# Altium schematic sheet SD.SchDoc
size B; SheetNumber: 5; SheetTotal: 5
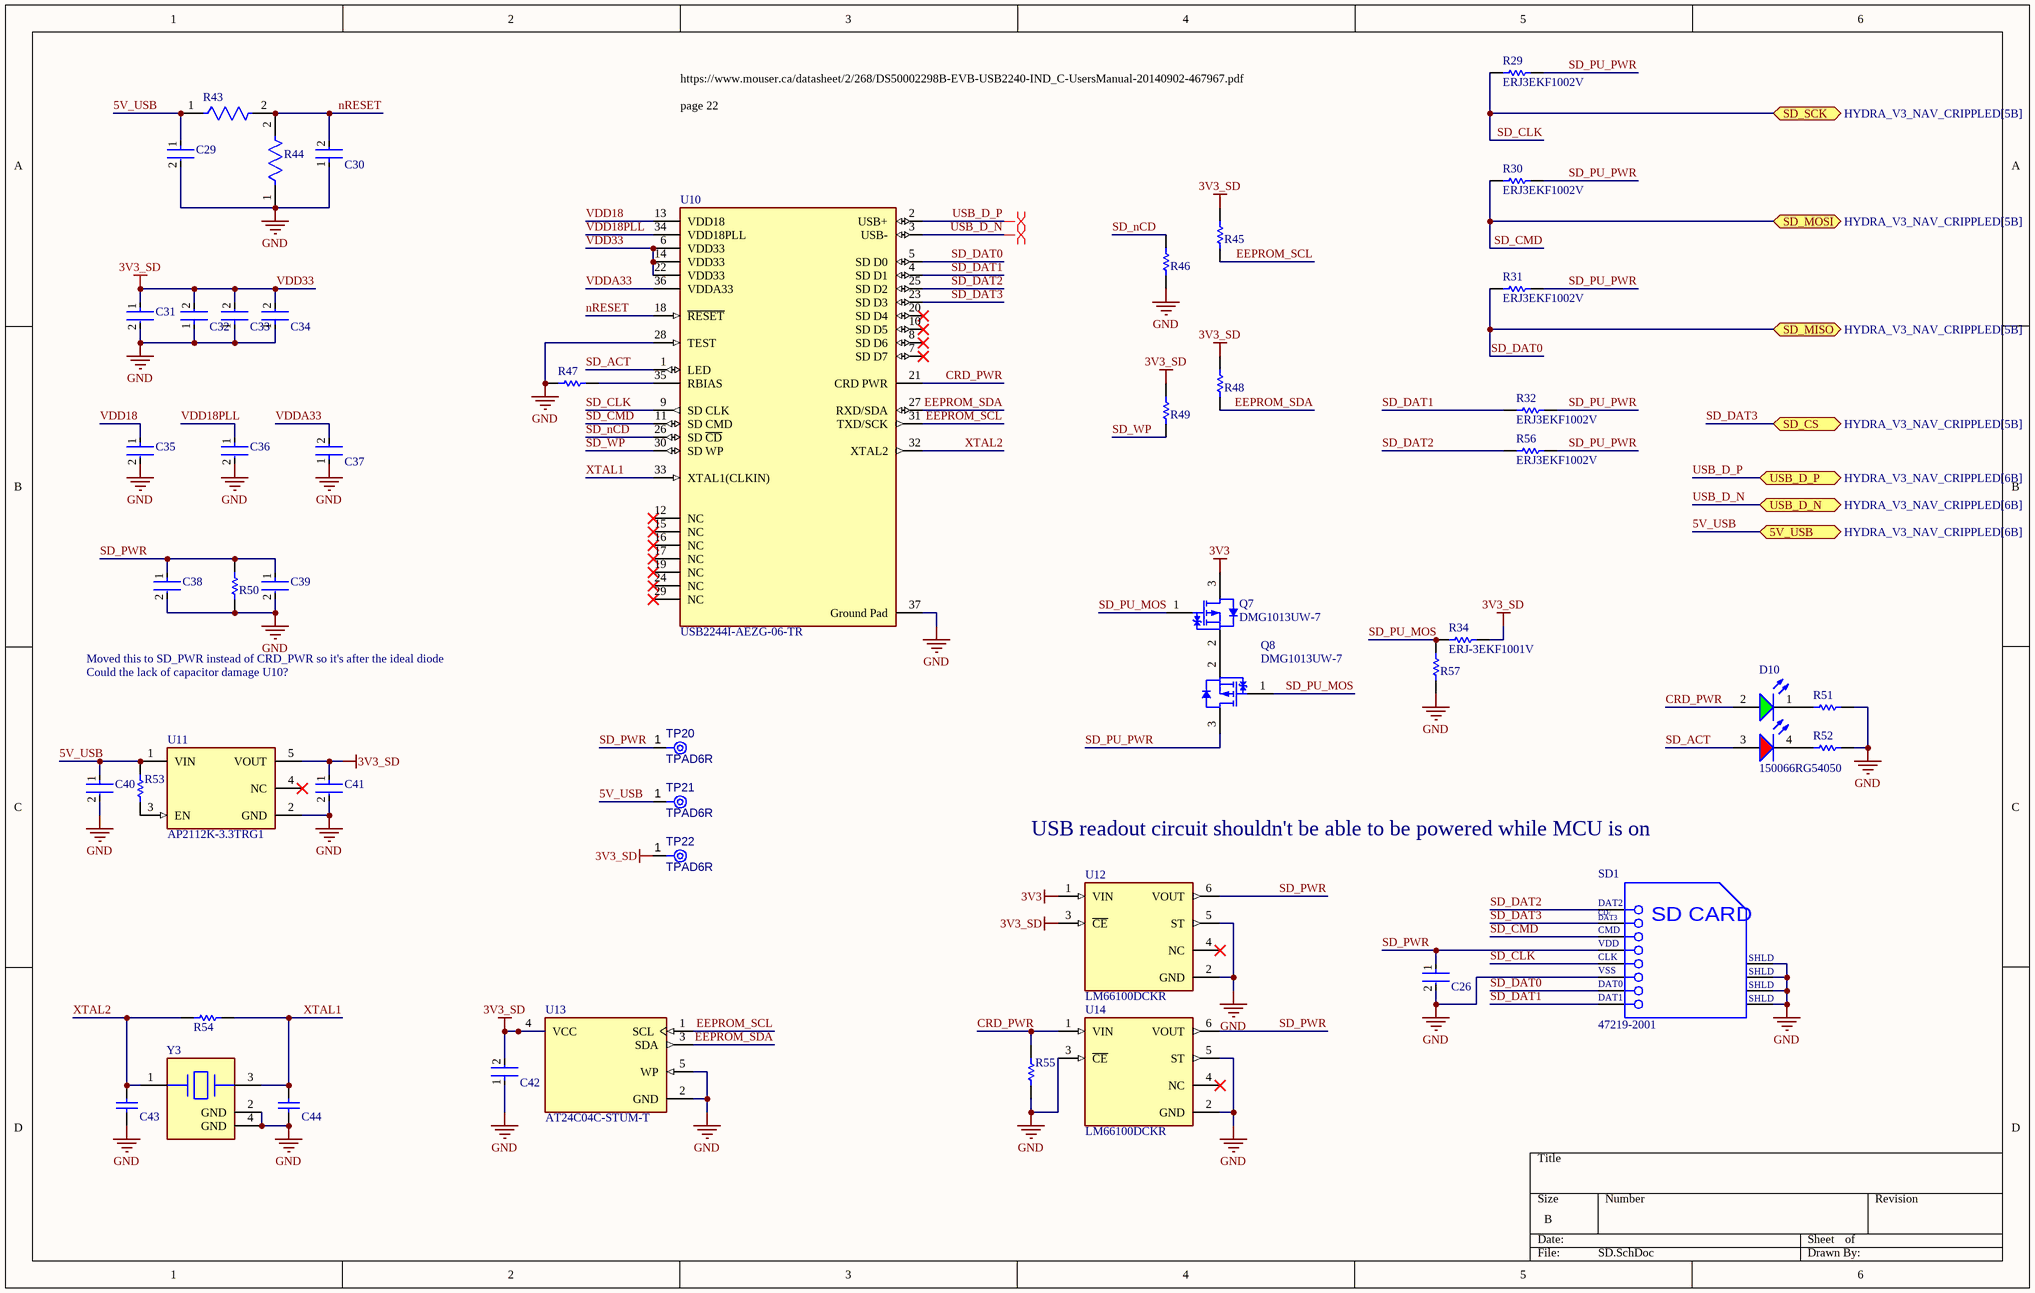
[diagram p0: SD.SchDoc]

## Parts
C26  C0402C104K8PACTU  [FP-C0402-BB-MFG]  (value not drawn)
C29  CC0603KRX7R7BB105  [FP-CC0603-DA-MFG]  (value not drawn)
C30  C0402C104K8PACTU  [FP-C0402-BB-MFG]  (value not drawn)
C31  C0603C475K9PACTU  [FP-C0603-CG-MFG]  (value not drawn)
C32  C0402C104K8PACTU  [FP-C0402-BB-MFG]  (value not drawn)
C33  C0402C104K8PACTU  [FP-C0402-BB-MFG]  (value not drawn)
C34  C0402C104K8PACTU  [FP-C0402-BB-MFG]  (value not drawn)
C35  CC0603KRX7R7BB105  [FP-CC0603-DA-MFG]  (value not drawn)
C36  CC0603KRX7R7BB105  [FP-CC0603-DA-MFG]  (value not drawn)
C37  C0402C104K8PACTU  [FP-C0402-BB-MFG]  (value not drawn)
C38  C0603C475K9PACTU  [FP-C0603-CG-MFG]  (value not drawn)
C39  CC0603KRX7R9BB102  [FP-CC0603-DA-MFG]  (value not drawn)
C40  CC0603KRX7R7BB105  [FP-CC0603-DA-MFG]  (value not drawn)
C41  CC0603KRX7R7BB105  [FP-CC0603-DA-MFG]  (value not drawn)
C42  C0402C104K8PACTU  [FP-C0402-BB-MFG]  (value not drawn)
C43  CC0603JRNPO9BN180  [CAPC1608X90X40LL10T20]  (value not drawn)
C44  CC0603JRNPO9BN180  [CAPC1608X90X40LL10T20]  (value not drawn)
D10  150066RG54050  [WL-SBCD_0606]
Q7  DMG1013UW-7  [DIOD-SOT323-3_V]
Q8  DMG1013UW-7  [DIOD-SOT323-3_V]
R29  ERJ3EKF1002V  [RESC1609X55X30LL15T15]
R30  ERJ3EKF1002V  [RESC1609X55X30LL15T15]
R31  ERJ3EKF1002V  [RESC1609X55X30LL15T15]
R32  ERJ3EKF1002V  [RESC1609X55X30LL15T15]
R34  ERJ-3EKF1001V  [RESC1608X55X30LL15T15]
R43  RC0603FR-07100KL  [FP-RC0603-0_55-MFG]  (value not drawn)
R44  RC0603FR-07100KL  [FP-RC0603-0_55-MFG]  (value not drawn)
R45  ERJ3EKF1002V  [RESC1609X55X30LL15T15]  (value not drawn)
R46  ERJ3EKF1002V  [RESC1609X55X30LL15T15]  (value not drawn)
R47  RC0603FR-0712KL  [RESC1608X55X25NL10T15]  (value not drawn)
R48  ERJ3EKF1002V  [RESC1609X55X30LL15T15]  (value not drawn)
R49  ERJ3EKF1002V  [RESC1609X55X30LL15T15]  (value not drawn)
R50  ERJ3EKF2201V  [RESC1608X55X30LL15T15]  (value not drawn)
R51  ERJ-3EKF3300V  [RESC1608X55X30LL15T15]  (value not drawn)
R52  ERJ-3EKF3300V  [RESC1608X55X30LL15T15]  (value not drawn)
R53  ERJ3EKF1002V  [RESC1609X55X30LL15T15]  (value not drawn)
R54  RT0603BRD071ML  [RESC1608X55X30NL20T20]  (value not drawn)
R55  ERJ3EKF1002V  [RESC1609X55X30LL15T15]  (value not drawn)
R56  ERJ3EKF1002V  [RESC1609X55X30LL15T15]
R57  ERJ3EKF1002V  [RESC1609X55X30LL15T15]  (value not drawn)
SD1  47219-2001  [MOLX-47219-2001-8_V]
TP20  TPAD6R  [TP06R]  (no BOM)
TP21  TPAD6R  [TP06R]  (no BOM)
TP22  TPAD6R  [TP06R]  (no BOM)
U10  USB2244I-AEZG-06-TR  [FP-36QFN-4106-6x6B-MFG]
U11  AP2112K-3.3TRG1  [FP-SOT25-IPC_A]
U12  LM66100DCKR  [LM66100DCKR-Footprint-1]
U13  AT24C04C-STUM-T  [FP-C04-21344-IPC_C]
U14  LM66100DCKR  [LM66100DCKR-Footprint-1]
Y3  ABM8AIG-24.000MHZ-12-2Z-T3  [FP-ABM8AIG-MFG]  (value not drawn)

## Ports
5V_USB (bidir, see HYDRA_V3_NAV_CRIPPLED[6B]), SD_CS (bidir, see HYDRA_V3_NAV_CRIPPLED[5B]), SD_MISO (bidir, see HYDRA_V3_NAV_CRIPPLED[5B]), SD_MOSI (bidir, see HYDRA_V3_NAV_CRIPPLED[5B]), SD_SCK (bidir, see HYDRA_V3_NAV_CRIPPLED[5B]), USB_D_N (bidir, see HYDRA_V3_NAV_CRIPPLED[6B]), USB_D_P (bidir, see HYDRA_V3_NAV_CRIPPLED[6B])

## Nets
3V3: Q7.3(D) U12.1(VIN)
GND: C26.2 C29.2 C30.1 C31.2 C32.1 C33.1 C34.1 C35.2 C36.2 C37.1 C38.2 C39.2 C40.2 C41.2 C42.1 C43.1 C44.1 R44.1 R46.1 R47.1 R50.1 R51.2 R52.2 R55.1 R57.1 SD1.6(VSS) SD1.9(SHLD) SD1.10(SHLD) SD1.11(SHLD) SD1.12(SHLD) U10.28(TEST) U10.37(Ground_Pad) U11.2(GND) U12.2(GND) U12.5(ST) U13.2(GND) U13.5(WP) U14.2(GND) U14.3(~{CE}) U14.5(ST) Y3.2(GND) Y3.4(GND)
VDD33: C31.1 C32.2 C33.2 C34.2 C41.1 C42.2 R34.2 R45.2 R48.2 R49.2 TP22.1(TP) U10.6(VDD33) U10.14(VDD33) U10.22(VDD33) U11.5(VOUT) U12.3(~{CE}) U13.4(VCC)  [also labelled 3V3_SD]
5V_USB: C29.1 C40.1 R43.1 R53.2 TP21.1(TP) U11.1(VIN) ; port 5V_USB
CRD_PWR: D10.2(A) R55.2 U10.21(CRD_PWR) U14.1(VIN)
EEPROM_SCL: R45.1 U10.31(TXD/SCK) U13.1(SCL)
EEPROM_SDA: R48.1 U10.27(RXD/SDA) U13.3(SDA)
nRESET: C30.2 R43.2 R44.2 U10.18(~{RESET})
SD_ACT: D10.3(A) U10.1(LED)
SD_CLK: R29.1 SD1.5(CLK) U10.9(SD_CLK) ; port SD_SCK
SD_CMD: R30.1 SD1.3(CMD) U10.11(SD_CMD) ; port SD_MOSI
SD_DAT0: R31.1 SD1.7(DAT0) U10.5(SD_D0) ; port SD_MISO
SD_DAT1: R32.1 SD1.8(DAT1) U10.4(SD_D1)
SD_DAT2: R56.1 SD1.1(DAT2) U10.25(SD_D2)
SD_DAT3: SD1.2(CD/DAT3) U10.23(SD_D3) ; port SD_CS
SD_nCD: R46.2 U10.26(SD_~{CD})
SD_PU_MOS: Q7.1(G) Q8.1(G) R34.1 R57.2
SD_PU_PWR: Q8.3(D) R29.2 R30.2 R31.2 R32.2 R56.2
SD_PWR: C26.1 C38.1 C39.1 R50.2 SD1.4(VDD) TP20.1(TP) U12.6(VOUT) U14.6(VOUT)
SD_WP: R49.1 U10.30(SD_WP)
USB_D_N: U10.3(USB-) ; port USB_D_N
USB_D_P: U10.2(USB+) ; port USB_D_P
VDD18: C35.1 U10.13(VDD18)
VDD18PLL: C36.1 U10.34(VDD18PLL)
VDDA33: C37.2 U10.36(VDDA33)
XTAL1: C44.2 R54.1 U10.33(XTAL1(CLKIN)) Y3.3
XTAL2: C43.2 R54.2 U10.32(XTAL2) Y3.1
NetD10_1: D10.1(K) R51.1
NetD10_4: D10.4(K) R52.1
NetQ7_2: Q7.2(S) Q8.2(S)
NetR47_2: R47.2 U10.35(RBIAS)
NetR53_1: R53.1 U11.3(EN)

Not connected (* = marked no-connect by the designer): U10 7(SD_D7)* 8(SD_D6)* 10(SD_D5)* 12(NC)* 15(NC)* 16(NC)* 17(NC)* 19(NC)* 20(SD_D4)* 24(NC)* 29(NC)*; U11 4(NC)*; U12 4(NC)*; U14 4(NC)*

## Layout directives
differential pair: USB_D_N, USB_D_P

## Notes on the sheet
- https://www.mouser.ca/datasheet/2/268/DS50002298B-EVB-USB2240-IND_C-UsersManual-20140902-467967.pdf
  page 22
- Moved this to SD_PWR instead of CRD_PWR so it's after the ideal diode
- Could the lack of capacitor damage U10?
- USB readout circuit shouldn't be able to be powered while MCU is on
- (in symbol CMP-2000-05245-1) CD/; DAT3; SD CARD

## Library data of the parts
C26 C30 C32-C34 C37 C42 = CMP-2008-02046-2: CAP CER 0.1UF 10V X5R 0402; Manufacturer: Kemet; Material: Ceramic; Capacitance: 0.10 μF; Temperature Coefficient: 15%; Tolerance: 0.1; Value: 0.10 μF; Package: C0402-BB; Temperature: -55°C to +125°C; ComponentLink2Description: Datasheet; Temperature Characteristic: X5R; Device Class L1: Passive Components; Height: 0.55mm; Lead Free: Yes; ComponentLink2URL: https://content.kemet.com/datasheets/KEM_C1002_X7R_SMD.pdf; Device Class L2: Capacitors; Temperature Range Low: -55°C; Temperature Range High: +125°C; RoHS: TRUE; Octopart: https://octopart.com/c0402c104k8pactu-kemet-140039; Automotive: No; Mouser Description: Capacitor 100 nF 10 VDC 0402; Category: Cap; Voltage Rating: 10 V; Digikey Description: CAP CER 0.1UF 10V X5R 0402; Ipc Land Pattern Name: CAPC10050X50; Device Class L3: Ceramic Capacitors; Manufacturer Part Number: C0402C104K8PACTU
C29 C35 C36 C40 C41 = CMP-03422-000924-1: CAP CER 1UF 16V X7R 0603; Manufacturer: YAGEO; Tolerance: 0.1; Temperature Coefficient: 15%; Material: Ceramic; Package: CC0603-DA; RoHS: TRUE; Device Class L2: Capacitors; Temperature Characteristic: X7R; Temperature: -55°C to +125°C; Temperature Range Low: -55°C; Automotive: No; ComponentLink2Description: Datasheet; Value: 1 uF; Lead Free: Yes; Capacitance: 1 uF; ComponentLink2URL: http://www.yageo.com/documents/recent/UPY-GPHC_X7R_6.3V-to-50V_18.pdf; Device Class L1: Passive Components; Voltage: 16 V; Octopart: https://octopart.com/cc0603krx7r7bb105-yageo-42271928; Category: Cap; Digikey Description: CAP CER 1UF 16V X7R 0603; Footprint Url: http://www.yageo.com/exep/pages/download/literatures/UPY-C_GEN_24.pdf; Height: 0.9mm; Manufacturer Part Number: CC0603KRX7R7BB105; Voltage Rating: 16 V; Temperature Range High: +125°C; Mouser Description: Multilayer Ceramic Capacitor, CC Series, 1 - F, - 10%, X7R, 16 V, 0603 [1608 Metric]; Device Class L3: Ceramic Capacitors
C31 C38 = CMP-2006-02256-2: CAP CER 4.7UF 6.3V X5R 0603; Manufacturer: Kemet; Temperature Coefficient: 15%; Tolerance: 10%; Material: Ceramic; Device Class L3: Ceramic Capacitors; RoHS: TRUE; Value: 4.7uF; Lead Free: Yes; ComponentLink2Description: Datasheet; Mouser Description: Multilayer Ceramic Capacitors MLCC - SMD/SMT 6.3volts 4.7uF X5R 10%; Package: C0603-CG; Digikey Description: CAP CER 4.7UF 6.3V X5R 0603; ComponentLink2URL: https://content.kemet.com/datasheets/KEM_C1006_X5R_SMD.pdf; Category: Cap; Temperature Range Low: -55°C; Capacitance: 4.7uF; Temperature: -55°C to +85°C; Octopart: https://octopart.com/c0603c475k9pactu-kemet-104242; Ipc Land Pattern Name: CAPC16080X80; Voltage Rating: 6.3V; Temperature Range High: +85°C; Height: 0.9mm; Temperature Characteristic: X5R; Device Class L1: Passive Components; Manufacturer Part Number: C0603C475K9PACTU; Automotive: No; Device Class L2: Capacitors
C39 = CMP-2100-03599-2: CAP CER 1000PF 50V X7R 0603; Manufacturer: YAGEO; Material: Ceramic; Capacitance: 1.0 nF; Tolerance: 0.1; Value: 1.0 nF; Temperature Coefficient: 15%; Device Class L3: Ceramic Capacitors; Automotive: No; Manufacturer Part Number: CC0603KRX7R9BB102; Digikey Description: CAP CER 1000PF 50V X7R 0603; Lead Free: Yes; Temperature Range High: +125°C; ComponentLink2URL: http://www.yageo.com/documents/recent/UPY-GPHC_X7R_6.3V-to-50V_18.pdf; Category: Cap; Footprint Url: http://www.yageo.com/exep/pages/download/literatures/UPY-C_GEN_24.pdf; RoHS: TRUE; Octopart: https://octopart.com/cc0603krx7r9bb102-yageo-192933; ComponentLink2Description: Datasheet; Device Class L2: Capacitors; Mouser Description: Multilayer Ceramic Capacitors MLCC - SMD/SMT 1.0nF 50V X7R 10%; Temperature Range Low: -55°C; Temperature Characteristic: X7R; Device Class L1: Passive Components; Temperature: -55°C to +125°C; Package: CC0603-DA; Voltage: 50 V; Voltage Rating: 50 V; Height: 0.9mm
C43 C44 = CMP-1659-00030-1: Chip Capacitor, 18 pF, +/- 5%, 50 V, -55 to 125 degC, 0603 (1608 Metric), RoHS, Tape and Reel; Voltage Rating: 50 V; Case\Package: 0603; Power Rating: 100 mW; Resistance: 68.1 Ohm; Tolerance: 1%; Case Code (Metric): 1608; Max Operating Temperature: 155 degC; RoHSCompliant: true; Case Code (Imperial): 0603; ComponentLink2Description: Datasheet; Package Quantity: 200; PackageReference: 0603; ComponentLink2URL: http://www.yageo.com/NewPortal/yageodocoutput?fileName=/pdf/MLCC/UPY-GP_NP0_16V-to-50V_14.pdf; Length: 1.6 mm; DatasheetVersion: Rev. 14, 07/2016; Min Operating Temperature: -55 degC; ComponentLink1URL: http://www.yageo.com/; Width: 0.8 mm; ComponentLink1Description: Manufacturer URL; Height: 0.45 mm; Radiation Hardening: No; PackageDescription: 2-Pin Surface Mount Device, Body 1.6 x 0.8 mm; Packaging: Tape and Reel
D10 = CMP-004-00034-2: Led, Red/Grn, 180Mcd/230Mcd, 624Nm/525Nm Rohs Compliant: Yes
Q7 Q8 = CMP-2000-06170-1: P-Channel Enhancement Mode MOSFET, 310 mW, 20 V, -55 to 150 degC, 3-Pin SOT-323, RoHS, Tape and Reel; Manufacturer: Diodes Inc; Qg Gate Charge: 0.622nC; Drain-Source On Resistance-Max: 750mO; Rated Power Dissipation: 310mW; Drain-to-Source Voltage [Vdss]: 20V; Package Reference: SOT323; Datasheet Version: Rev. 3-2, 09/2013; Package Description: 3-Pin Small Outline Transistor, Body 2 x 1.25 mm, Pitch 0.65 mm; Mounting Technology: SurfaceMount; Manufacturer URL: http://www.diodes.com/; Datasheet URL: http://www.diodes.com/_files/datasheets/ds31861.pdf; Channel Type: P-Channel
R29-R32 R45 R46 R48 R49 R53 R55-R57 = CMP-1012-00623-3: Chip Resistor, 10 KOhm, +/- 1%, 0.1 W, -55 to 155 degC, 0603 (1608 Metric), RoHS, Tape and Reel; Manufacturer: Panasonic; Voltage Rating: 75V; Case\/Package: 0603; Power Rating: 100mW; Resistance: 10KOhm; Temperature Coefficient: 100ppm\/degreesC; Number of Pins: 2; Package Reference: 603; Depth: 0.8mm; Mount: SurfaceMount; Package Description: 2-Pin Surface Mount Device, Body 1.6 x 0.85 mm; Datasheet Version: 02/2017; Length: 1.6mm; Lead Free: LeadFree; Height: 0.45mm; Number of Terminations: 2; Max Power Dissipation: 100mW; Min Operating Temperature: -55degC; Datasheet URL: https://industrial.panasonic.com/cdbs/www-data/pdf/RDA0000/AOA0000C304.pdf; Termination: SMD/SMT; Case Code (Metric): 1608; Case Code (Imperial): 0603; Tolerance: 1%; Max Operating Temperature: 155degC; RoHSCompliant: true; Voltage Rating (DC): 75V; Radiation Hardening: No; Packaging: TapeandReel; Composition: ThickFilm; Mounting Technology: SurfaceMount; Manufacturer URL: http://www.panasonic.com/; Width: 0.031inch; REACH SVHC: NoSVHC; Contact Plating: Tin; Military Standard: Not; Package Quantity: 1
R34 = CMP-2000-00180-1: Manufacturer: Panasonic; Part Number: ERJ-3EKF1001V
R43 R44 = CMP-2100-03662-2: RES SMD 100K OHM 1% 1/10W 0603; Voltage Rating (DC): 50V; Resistance: 100kR; Max Power Dissipation: 100mW; Temperature Coefficient: 100ppm/°C; Working Voltage: 75V; Length: 1.6mm; Lead Free: Lead Free; Number of Terminations: 2; Packaging: Tape and Reel; Voltage Rating: 50V; Termination: SMD/SMT; Width: 0.8mm; Resistor Type: Thick Film; Resistance Tolerance: 1%; Features: Moisture Resistant; Height: 0.45mm; Construction: Rectangular; Case/Package: 0603; Military Standard: Not; Case Code (Imperial): 0603; Series: RC; Technology: THICK FILM; Depth: 0.8mm; RoHS Compliant: Yes; REACH SVHC: No SVHC; Min Operating Temperature: -55°C; Case Code (Metric): 1608; Max Operating Temperature: 155°C; Power Rating: 100mW; Number of Pins: 2; Tolerance: 1%
R47 = CMP-1659-00047-2: Chip Resistor, 12 KOhm, +/- 1%, 100 mW, -55 to 155 degC, 0603 (1608 Metric), RoHS, Tape and Reel; Resistance: 12 kohm; Power Rating: 100 mW; Voltage Rating (DC): 50 V; Case\Package: 0603; ComponentLink2URL: http://www.yageo.com/documents/recent/PYu-RC_Group_51_RoHS_L_04.pdf; Case Code (Imperial): 0603; ComponentLink2Description: Datasheet; Height: 0.45 mm; Case Code (Metric): 1608; RoHSCompliant: true; Max Operating Temperature: 155 degC; Width: 0.8 mm; Mount: Surface Mount; ComponentLink1URL: http://www.yageo.com/; Pins: 2; Tolerance: 1%; Min Operating Temperature: -55 degC; Length: 1.6 mm; PackageReference: 0603; REACH SVHC: No SVHC; PackageDescription: 2-Pin Surface Mount Device, Body 1.6 x 0.8 mm; Voltage Rating: 50 V; Packaging: Tape and Reel; Package Quantity: 5000; ComponentLink1Description: Manufacturer URL; DatasheetVersion: Rev. 4, 02/2016
R50 = CMP-2000-00336-1: Manufacturer: Panasonic; Part Number: ERJ3EKF2201V
R51 R52 = CMP-2000-00435-2: Chip Resistor, 330 Ohm, +/- 1%, 0.1 W, -55 to 155 degC, 0603 (1608 Metric), RoHS, Tape and Reel; Gender: Male; Mating Cycles: 10000; Current Rating: 500 mA; Voltage Rating: 10 V; REACH SVHC: No SVHC; PackageDescription: 2-Pin Surface Mount Device, Body 1.6 x 0.85 mm; Contact Finish: Gold; Pins: 8; ComponentLink1Description: Manufacturer URL; Packaging: Tape and Reel; Max Operating Temperature: 85 degC; Contact Material: Copper; Height: 1.45 mm; Width: 1.45 mm; DatasheetVersion: Apr-15; Package Quantity: 1500; Contact Plating: Gold; PackageReference: 0603; Mount: Surface Mount; Lead Pitch: 1.1 mm; Min Operating Temperature: -25 degC; ComponentLink1URL: http://www.panasonic.com/; ComponentLink2URL: http://industrial.panasonic.com/cdbs/www-data/pdf/RDA0000/AOA0000C86.pdf; Length: 13.7 mm; ComponentLink2Description: Datasheet; RoHSCompliant: true
R54 = CMP-2000-00925-1: NOT PANASONIC, THIS IS A 1M RESISTORhttps://www.yageo.com/upload/media/product/productsearch/datasheet/rchip/PYu-RT_1-to-0.01_RoHS_L_13.pdf; Part Number: ERA-3AEB163V; Manufacturer: Panasonic
SD1 = CMP-2000-05245-1: MicroSD Card Connector, Hinge Type, -40 to 85 degC, 8-Pin SMD, RoHS, Tape and Reel; Manufacturer: Molex; Current Rating: 500mA; Number of Contacts: 8; Pitch: 1.09mm; Insertion - Extraction Style: Hinged; Voltage Rating: 100VDC; Product: CardConnectors; Contact Material: CopperAlloy; Series: 47219; Packaging: Reel; Brand: Molex; Product Category: MemoryCardConnectors; Housing Material: Thermoplastic; Mounting Style: SMD/SMT; Termination Style: SMD; Datasheet Version: Rev. F, 06/2009; Card Type: microSD; Manufacturer URL: http://www.molex.com/; RoHS: Details; Datasheet URL: http://www.molex.com/pdm_docs/sd/472192001_sd.pdf; Factory Pack Quantity: 2400
TP20-TP22 = CMP-00028-00002-2: 0.6mm round; Pins: 1
U10 = CMP-06284-000008-1: IC USB FLASH MEDIA CTRLR 36QFN; Manufacturer: Microchip; Max Supply Voltage: 3.6V; Nominal Supply Current: 80-135mA; Interface: SPI,UART,USB; Min Supply Voltage: 3V; Data Rate: 35Mbits/s; Standoff Height: 0mm; Usb Standard: USB 2.0; Temperature Range Low: -40°C; Manufacturer Part Number: USB2244I-AEZG-06-TR; Ambient Temperature Range High: +85°C; Automotive: No; Device Class L1: Integrated Circuits (ICs); Device Class L2: Interface ICs; Mouser Description: USB Interface IC USB 2.0 SD/MMC Flash Media Contrl; Temperature: -40°C to +85°C; Height: 0.9mm; Temperature Range High: +85°C; Package: 36QFN-4106-6x6B; Device Class L3: USB Interface ICs; ComponentLink2Description: Datasheet; RoHS: TRUE; Octopart: https://octopart.com/usb2244i-aezg-06-tr-microchip-34964624; Category: IC; Ipc Land Pattern Name: QFN50P600X600X85-36; ComponentLink2URL: http://ww1.microchip.com/downloads/en/DeviceDoc/00001979A.pdf; Digikey Description: IC USB FLASH MEDIA CTRLR 36QFN; Ambient Temperature Range Low: -40°C; Lead Free: Yes
U11 = CMP-12756-000035-1: IC REG LINEAR 3.3V 600MA SOT25; Number of Regulators: 1; Output Type: Fixed; Polarity: Positive; Min Input Voltage: 2.5V; Max Input Voltage: 6V; Accuracy: 1.5%; Quiescent Current: 55uA; Dropout Voltage: 250mV; Min Operating Temperature: -40°C; Length: 3.1mm; Output Current: 600mA; Max Operating Temperature: 85°C; Package Quantity: 1; Output Voltage: 3.3V; Width: 1.7mm; Number of Outputs: 1; Packaging: Tape and Reel; Height: 1.3mm; Lead Free: Lead Free; Max Output Current: 600mA; Case/Package: SOT-23-5; Mount: Surface Mount; Number of Pins: 5
U12 U14 = CMP-004-00039-1: 1.5-V to 5.5-V, 1.5-A, 0.5-uA IQ ideal diode with Integrated FET 6-SC70 -40 to 105
U13 = CMP-06313-000151-1: IC EEPROM 4KBIT I2C 1MHZ SOT23-5; Nominal Supply Current: 3mA; Frequency: 400kHz; Min Supply Voltage: 1.7V; Max Supply Voltage: 5.5V; Access Time-Max: 900ns; Interface: Serial; Write Protection: YES; Density: 4096b; Organization: 512X8; Package Quantity: 1; Supply Current: 3mA; Min Operating Temperature: -40°C; Case/Package: SOT-23; Max Frequency: 400kHz; Radiation Hardening: No; Max Operating Temperature: 85°C; Packaging: Tape and Reel; Number of Pins: 5; Series: -; Access Time: 900ns; Mount: Surface Mount; Lead Free: Lead Free; RoHS Compliant: Yes; Memory Type: EEPROM
Y3 = CMP-27762-015716-1: Crystal 24MHz ±20ppm (Tol) ±50ppm (Stability) 12pF FUND 50Ω Automotive 4-Pin Ultra Mini-CSMD T/R; ESR (Equivalent Series Resistance): 50R; Series: ABM8AIG; RoHS Compliant: Yes; Load Capacitance: 12pF; Height: 0.031inch; Min Operating Temperature: -40°C; Mount: Surface Mount; Packaging: Cut Tape; Ratings: AEC-Q200; Case/Package: SMD/SMT; Frequency Stability: 50ppm; Max Operating Temperature: 125°C; Length: 0.126inch; Frequency: 24MHz; Frequency Tolerance: 20ppm; Width: 0.098inch